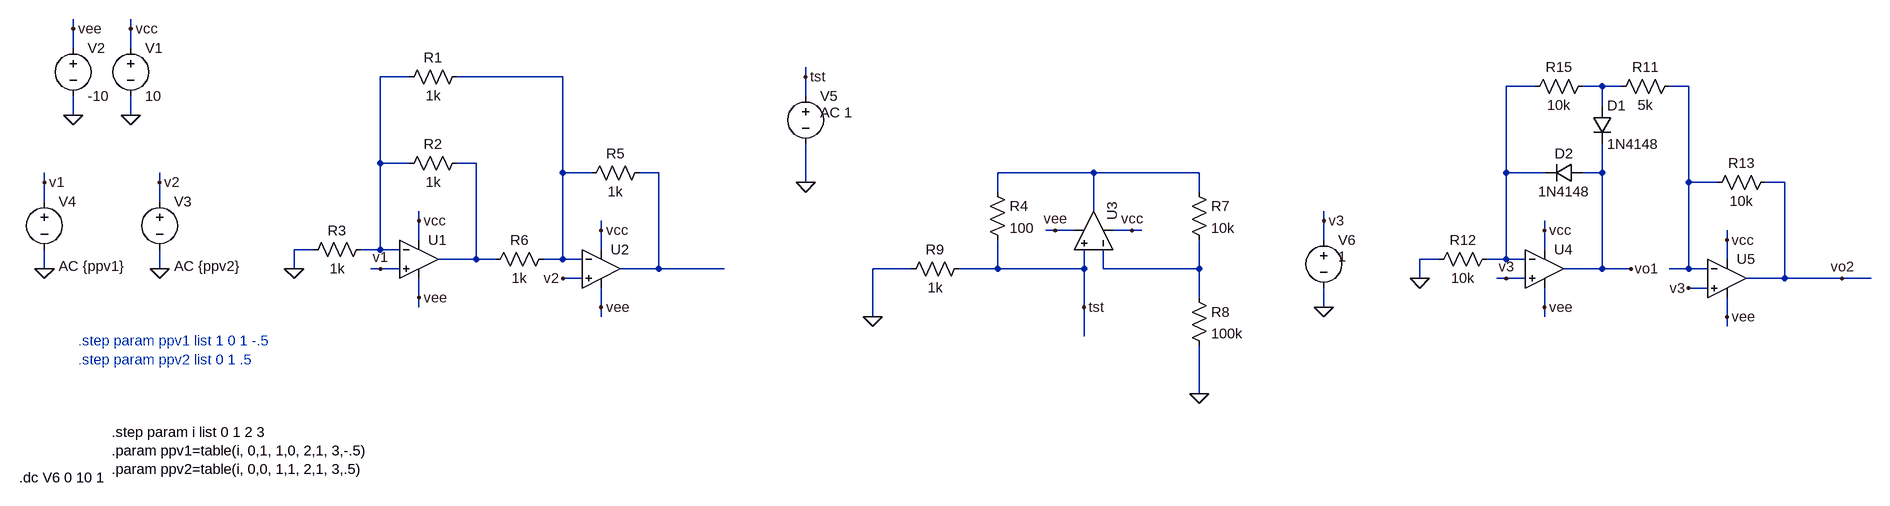
[diagram p0: schematic tpl1.asc]
tpl1.asc, the LTspice schematic file:
Version 4
SHEET 1 3064 680
WIRE -416 -224 -416 -240
WIRE -320 -224 -320 -240
WIRE -416 -192 -416 -224
WIRE -320 -192 -320 -224
WIRE 144 -144 96 -144
WIRE 400 -144 224 -144
WIRE 1008 -144 1008 -160
WIRE 2352 -128 2304 -128
WIRE 2464 -128 2432 -128
WIRE 2496 -128 2464 -128
WIRE 2608 -128 2576 -128
WIRE 1008 -112 1008 -144
WIRE 2464 -96 2464 -128
WIRE -416 -80 -416 -112
WIRE -320 -80 -320 -112
WIRE 96 0 96 -144
WIRE 144 0 96 0
WIRE 256 0 224 0
WIRE 400 16 400 -144
WIRE 448 16 400 16
WIRE 560 16 528 16
WIRE 1488 16 1328 16
WIRE 1664 16 1488 16
WIRE 2304 16 2304 -128
WIRE 2368 16 2304 16
WIRE 2464 16 2464 -32
WIRE 2464 16 2432 16
WIRE -464 32 -464 16
WIRE -272 32 -272 16
WIRE 1008 32 1008 -32
WIRE 2608 32 2608 -128
WIRE 2656 32 2608 32
WIRE 2768 32 2736 32
WIRE 1328 48 1328 16
WIRE 1664 48 1664 16
WIRE -464 64 -464 32
WIRE -272 64 -272 32
WIRE 1488 80 1488 16
WIRE 160 96 160 80
WIRE 2000 96 2000 80
WIRE 464 112 464 96
WIRE 1424 112 1408 112
WIRE 1456 112 1424 112
WIRE 1552 112 1520 112
WIRE 1568 112 1552 112
WIRE 2368 112 2368 96
WIRE 160 128 160 96
WIRE 2000 128 2000 96
WIRE 2672 128 2672 112
WIRE -16 144 -48 144
WIRE 96 144 96 0
WIRE 96 144 64 144
WIRE 128 144 96 144
WIRE 464 144 464 112
WIRE 2368 144 2368 112
WIRE 256 160 256 0
WIRE 256 160 192 160
WIRE 288 160 256 160
WIRE 400 160 400 16
WIRE 400 160 368 160
WIRE 432 160 400 160
WIRE 2192 160 2160 160
WIRE 2304 160 2304 16
WIRE 2304 160 2272 160
WIRE 2336 160 2304 160
WIRE 2672 160 2672 128
WIRE -464 176 -464 144
WIRE -272 176 -272 144
WIRE -48 176 -48 144
WIRE 96 176 80 176
WIRE 128 176 96 176
WIRE 560 176 560 16
WIRE 560 176 496 176
WIRE 704 176 560 176
WIRE 1184 176 1120 176
WIRE 1328 176 1328 128
WIRE 1328 176 1264 176
WIRE 1472 176 1472 144
WIRE 1472 176 1328 176
WIRE 1504 176 1504 144
WIRE 1664 176 1664 128
WIRE 1664 176 1504 176
WIRE 2464 176 2464 16
WIRE 2464 176 2400 176
WIRE 2512 176 2464 176
WIRE 2608 176 2608 32
WIRE 2608 176 2576 176
WIRE 2640 176 2608 176
WIRE 432 192 400 192
WIRE 2160 192 2160 160
WIRE 2304 192 2288 192
WIRE 2336 192 2304 192
WIRE 2768 192 2768 32
WIRE 2768 192 2704 192
WIRE 2864 192 2768 192
WIRE 2912 192 2864 192
WIRE 2640 208 2608 208
WIRE 160 224 160 192
WIRE 1664 224 1664 176
WIRE 160 240 160 224
WIRE 464 240 464 208
WIRE 1472 240 1472 176
WIRE 2000 240 2000 208
WIRE 2368 240 2368 208
WIRE 464 256 464 240
WIRE 1120 256 1120 176
WIRE 2368 256 2368 240
WIRE 2672 256 2672 224
WIRE 2672 272 2672 256
WIRE 1472 288 1472 240
WIRE 1664 384 1664 304
FLAG -320 -80 0
FLAG -320 -224 vcc
FLAG -416 -80 0
FLAG -416 -224 vee
FLAG 160 224 vee
FLAG 160 96 vcc
FLAG -272 176 0
FLAG -272 32 v2
FLAG -48 176 0
FLAG 464 240 vee
FLAG 464 112 vcc
FLAG -464 176 0
FLAG -464 32 v1
FLAG 96 176 v1
FLAG 400 192 v2
FLAG 1424 112 vee
FLAG 1552 112 vcc
FLAG 1664 384 0
FLAG 1120 256 0
FLAG 1008 32 0
FLAG 1008 -144 tst
FLAG 1472 240 tst
FLAG 2368 240 vee
FLAG 2368 112 vcc
FLAG 2160 192 0
FLAG 2672 256 vee
FLAG 2672 128 vcc
FLAG 2864 192 vo2
FLAG 2304 192 v3
FLAG 2608 208 v3
FLAG 2000 240 0
FLAG 2000 96 v3
FLAG 2512 176 vo1
SYMBOL OpAmps\\UniversalOpamp2 160 160 R0
SYMATTR InstName U1
SYMBOL voltage -320 -208 R0
WINDOW 123 0 0 Left 0
WINDOW 39 0 0 Left 0
SYMATTR InstName V1
SYMATTR Value 10
SYMBOL voltage -416 -208 R0
WINDOW 123 0 0 Left 0
WINDOW 39 0 0 Left 0
SYMATTR InstName V2
SYMATTR Value -10
SYMBOL res 240 -16 R90
WINDOW 0 0 56 VBottom 2
WINDOW 3 32 56 VTop 2
SYMATTR InstName R2
SYMATTR Value 1k
SYMBOL res 80 128 R90
WINDOW 0 0 56 VBottom 2
WINDOW 3 32 56 VTop 2
SYMATTR InstName R3
SYMATTR Value 1k
SYMBOL voltage -272 48 R0
WINDOW 123 24 124 Left 2
WINDOW 39 0 0 Left 0
SYMATTR Value2 AC {ppv2}
SYMATTR InstName V3
SYMATTR Value ""
SYMBOL OpAmps\\UniversalOpamp2 464 176 R0
SYMATTR InstName U2
SYMBOL res 544 0 R90
WINDOW 0 0 56 VBottom 2
WINDOW 3 32 56 VTop 2
SYMATTR InstName R5
SYMATTR Value 1k
SYMBOL res 384 144 R90
WINDOW 0 0 56 VBottom 2
WINDOW 3 32 56 VTop 2
SYMATTR InstName R6
SYMATTR Value 1k
SYMBOL res 240 -160 R90
WINDOW 0 0 56 VBottom 2
WINDOW 3 32 56 VTop 2
SYMATTR InstName R1
SYMATTR Value 1k
SYMBOL voltage -464 48 R0
WINDOW 123 24 124 Left 2
WINDOW 39 0 0 Left 0
SYMATTR Value2 AC {ppv1}
SYMATTR InstName V4
SYMATTR Value ""
SYMBOL OpAmps\\UniversalOpamp2 1488 112 M270
SYMATTR InstName U3
SYMBOL res 1312 32 R0
SYMATTR InstName R4
SYMATTR Value 100
SYMBOL res 1648 32 R0
SYMATTR InstName R7
SYMATTR Value 10k
SYMBOL res 1648 208 R0
SYMATTR InstName R8
SYMATTR Value 100k
SYMBOL res 1280 160 R90
WINDOW 0 0 56 VBottom 2
WINDOW 3 32 56 VTop 2
SYMATTR InstName R9
SYMATTR Value 1k
SYMBOL voltage 1008 -128 R0
WINDOW 123 24 44 Left 2
WINDOW 39 0 0 Left 0
SYMATTR Value2 AC 1
SYMATTR InstName V5
SYMATTR Value ""
SYMBOL OpAmps\\UniversalOpamp2 2368 176 R0
SYMATTR InstName U4
SYMBOL res 2288 144 R90
WINDOW 0 0 56 VBottom 2
WINDOW 3 32 56 VTop 2
SYMATTR InstName R12
SYMATTR Value 10k
SYMBOL OpAmps\\UniversalOpamp2 2672 192 R0
SYMATTR InstName U5
SYMBOL res 2752 16 R90
WINDOW 0 0 56 VBottom 2
WINDOW 3 32 56 VTop 2
SYMATTR InstName R13
SYMATTR Value 10k
SYMBOL res 2448 -144 R90
WINDOW 0 0 56 VBottom 2
WINDOW 3 32 56 VTop 2
SYMATTR InstName R15
SYMATTR Value 10k
SYMBOL voltage 2000 112 R0
WINDOW 123 24 124 Left 2
WINDOW 39 0 0 Left 0
WINDOW 3 24 44 Left 2
SYMATTR InstName V6
SYMATTR Value 1
SYMBOL diode 2448 -96 R0
SYMATTR InstName D1
SYMATTR Value 1N4148
SYMBOL diode 2432 0 R90
WINDOW 0 0 32 VBottom 2
WINDOW 3 32 32 VTop 2
SYMATTR InstName D2
SYMATTR Value 1N4148
SYMBOL res 2592 -144 R90
WINDOW 0 0 56 VBottom 2
WINDOW 3 32 56 VTop 2
SYMATTR InstName R11
SYMATTR Value 5k
TEXT -408 296 Left 2 ;.step param ppv1 list 1 0 1 -.5\n.step param ppv2 list 0 1 .5
TEXT -352 448 Left 2 !.step param i list 0 1 2 3\n.param ppv1=table(i, 0,1, 1,0, 2,1, 3,-.5)\n.param ppv2=table(i, 0,0, 1,1, 2,1, 3,.5)
TEXT -506 524 Left 2 !.dc V6 0 10 1

The netlist it stands for:
* tpl1.asc
XU1 v1 N001 vcc vee N006 level.2 Avol=1Meg GBW=10Meg Slew=10Meg ilimit=25m rail=0 Vos=0 phimargin=45 en=0 enk=0 in=0 ink=0 Rin=500Meg  ; pins IN+ IN- V+ V- OUT
V1 vcc 0 10
V2 vee 0 -10
R2 N006 N001 1k
R3 N001 0 1k
V3 v2 0 AC {ppv2}
XU2 v2 N002 vcc vee N007 level.2 Avol=1Meg GBW=10Meg Slew=10Meg ilimit=25m rail=0 Vos=0 phimargin=45 en=0 enk=0 in=0 ink=0 Rin=500Meg  ; pins IN+ IN- V+ V- OUT
R5 N007 N002 1k
R6 N002 N006 1k
R1 N002 N001 1k
V4 v1 0 AC {ppv1}
XU3 tst N009 vcc vee N008 level.2 Avol=1Meg GBW=10Meg Slew=10Meg ilimit=25m rail=0 Vos=0 phimargin=45 en=0 enk=0 in=0 ink=0 Rin=500Meg  ; pins IN+ IN- V+ V- OUT
R4 N008 tst 100
R7 N008 N009 10k
R8 N009 0 100k
R9 tst 0 1k
V5 tst 0 AC 1
XU4 v3 N003 vcc vee vo1 level.2 Avol=1Meg GBW=10Meg Slew=10Meg ilimit=25m rail=0 Vos=0 phimargin=45 en=0 enk=0 in=0 ink=0 Rin=500Meg  ; pins IN+ IN- V+ V- OUT
R12 N003 0 10k
XU5 v3 N005 vcc vee vo2 level.2 Avol=1Meg GBW=10Meg Slew=10Meg ilimit=25m rail=0 Vos=0 phimargin=45 en=0 enk=0 in=0 ink=0 Rin=500Meg  ; pins IN+ IN- V+ V- OUT
R13 vo2 N005 10k
R15 N004 N003 10k
V6 v3 0 1
D1 N004 vo1 1N4148
D2 vo1 N003 1N4148
R11 N005 N004 5k
.model D D
.lib standard.dio
* .step param ppv1 list 1 0 1 -.5
* .step param ppv2 list 0 1 .5
.step param i list 0 1 2 3
.param ppv1=table(i, 0,1, 1,0, 2,1, 3,-.5)
.param ppv2=table(i, 0,0, 1,1, 2,1, 3,.5)
.dc V6 0 10 1
.lib UniversalOpamps2.sub
.backanno
.end